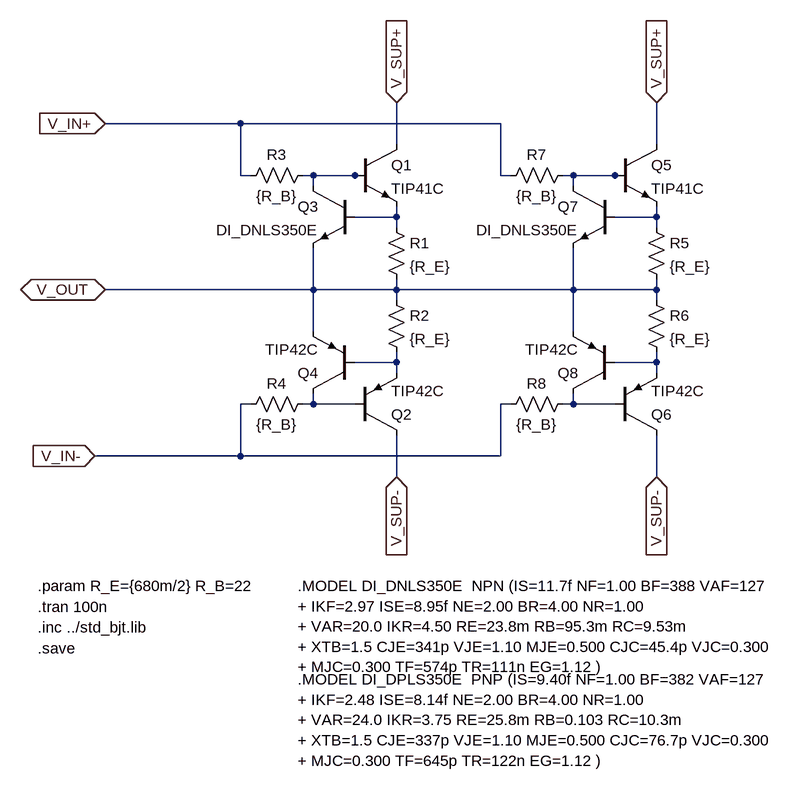
[diagram p0: schematic outstage.asc]
outstage.asc, the LTspice schematic file:
Version 4
SHEET 1 5688 824
WIRE -80 -160 -288 -160
WIRE 320 -160 -80 -160
WIRE 160 -128 160 -192
WIRE 560 -128 560 -192
WIRE -80 -80 -80 -160
WIRE -64 -80 -80 -80
WIRE 32 -80 16 -80
WIRE 96 -80 32 -80
WIRE 112 -80 96 -80
WIRE 320 -80 320 -160
WIRE 336 -80 320 -80
WIRE 432 -80 416 -80
WIRE 496 -80 432 -80
WIRE 512 -80 496 -80
WIRE 32 -64 32 -80
WIRE 432 -64 432 -80
WIRE 160 -16 160 -32
WIRE 160 -16 96 -16
WIRE 560 -16 560 -32
WIRE 560 -16 496 -16
WIRE 160 0 160 -16
WIRE 560 0 560 -16
WIRE 32 96 32 32
WIRE 32 96 -288 96
WIRE 160 96 160 80
WIRE 160 96 32 96
WIRE 432 96 432 32
WIRE 432 96 160 96
WIRE 560 96 560 80
WIRE 560 96 432 96
WIRE 160 112 160 96
WIRE 560 112 560 96
WIRE 32 160 32 96
WIRE 432 160 432 96
WIRE 160 208 160 192
WIRE 160 208 96 208
WIRE 560 208 560 192
WIRE 560 208 496 208
WIRE 160 224 160 208
WIRE 560 224 560 208
WIRE -64 272 -80 272
WIRE 32 272 32 256
WIRE 32 272 16 272
WIRE 96 272 32 272
WIRE 336 272 320 272
WIRE 432 272 432 256
WIRE 432 272 416 272
WIRE 496 272 432 272
WIRE -80 352 -80 272
WIRE -80 352 -304 352
WIRE 320 352 320 272
WIRE 320 352 -80 352
WIRE 160 384 160 320
WIRE 560 384 560 320
FLAG 160 -192 V_SUP+
IOPIN 160 -192 In
FLAG 160 384 V_SUP-
IOPIN 160 384 In
FLAG -288 -160 V_IN+
IOPIN -288 -160 In
FLAG -304 352 V_IN-
IOPIN -304 352 In
FLAG -288 96 V_OUT
IOPIN -288 96 BiDir
FLAG 560 -192 V_SUP+
IOPIN 560 -192 In
FLAG 560 384 V_SUP-
IOPIN 560 384 In
SYMBOL npn 96 -128 R0
SYMATTR InstName Q1
SYMATTR Value TIP41C
SYMBOL pnp 96 320 M180
SYMATTR InstName Q2
SYMATTR Value TIP42C
SYMBOL res 144 -16 R0
SYMATTR InstName R1
SYMATTR Value {R_E}
SYMBOL res 144 96 R0
SYMATTR InstName R2
SYMATTR Value {R_E}
SYMBOL npn 96 -64 M0
SYMATTR InstName Q3
SYMATTR Value DI_DNLS350E
SYMBOL res 32 -96 R90
WINDOW 0 0 56 VBottom 2
WINDOW 3 32 56 VTop 2
SYMATTR InstName R3
SYMATTR Value {R_B}
SYMBOL pnp 96 256 R180
SYMATTR InstName Q4
SYMATTR Value TIP42C
SYMBOL res 32 256 R90
WINDOW 0 0 56 VBottom 2
WINDOW 3 32 56 VTop 2
SYMATTR InstName R4
SYMATTR Value {R_B}
SYMBOL npn 496 -128 R0
SYMATTR InstName Q5
SYMATTR Value TIP41C
SYMBOL pnp 496 320 M180
SYMATTR InstName Q6
SYMATTR Value TIP42C
SYMBOL res 544 -16 R0
SYMATTR InstName R5
SYMATTR Value {R_E}
SYMBOL res 544 96 R0
SYMATTR InstName R6
SYMATTR Value {R_E}
SYMBOL npn 496 -64 M0
SYMATTR InstName Q7
SYMATTR Value DI_DNLS350E
SYMBOL res 432 -96 R90
WINDOW 0 0 56 VBottom 2
WINDOW 3 32 56 VTop 2
SYMATTR InstName R7
SYMATTR Value {R_B}
SYMBOL pnp 496 256 R180
SYMATTR InstName Q8
SYMATTR Value TIP42C
SYMBOL res 432 256 R90
WINDOW 0 0 56 VBottom 2
WINDOW 3 32 56 VTop 2
SYMATTR InstName R8
SYMATTR Value {R_B}
TEXT -392 616 Left 2 !.inc ../std_bjt.lib
TEXT -392 584 Left 2 !.tran 100n
TEXT -392 552 Left 2 !.param R_E={680m/2} R_B=22
TEXT -392 648 Left 2 !.save
TEXT 8 552 Left 2 !.MODEL DI_DNLS350E  NPN (IS=11.7f NF=1.00 BF=388 VAF=127\n+ IKF=2.97 ISE=8.95f NE=2.00 BR=4.00 NR=1.00\n+ VAR=20.0 IKR=4.50 RE=23.8m RB=95.3m RC=9.53m\n+ XTB=1.5 CJE=341p VJE=1.10 MJE=0.500 CJC=45.4p VJC=0.300\n+ MJC=0.300 TF=574p TR=111n EG=1.12 )
TEXT 8 696 Left 2 !.MODEL DI_DPLS350E  PNP (IS=9.40f NF=1.00 BF=382 VAF=127\n+ IKF=2.48 ISE=8.14f NE=2.00 BR=4.00 NR=1.00\n+ VAR=24.0 IKR=3.75 RE=25.8m RB=0.103 RC=10.3m\n+ XTB=1.5 CJE=337p VJE=1.10 MJE=0.500 CJC=76.7p VJC=0.300\n+ MJC=0.300 TF=645p TR=122n EG=1.12 )

The netlist it stands for:
* outstage.asc
Q1 V_SUP+ N001 N003 0 TIP41C
Q2 V_SUP- N007 N005 0 TIP42C
R1 N003 V_OUT {R_E}
R2 V_OUT N005 {R_E}
Q3 N001 N003 V_OUT 0 DI_DNLS350E
R3 N001 V_IN+ {R_B}
Q4 N007 N005 V_OUT 0 TIP42C
R4 N007 V_IN- {R_B}
Q5 V_SUP+ N002 N004 0 TIP41C
Q6 V_SUP- N008 N006 0 TIP42C
R5 N004 V_OUT {R_E}
R6 V_OUT N006 {R_E}
Q7 N002 N004 V_OUT 0 DI_DNLS350E
R7 N002 V_IN+ {R_B}
Q8 N008 N006 V_OUT 0 TIP42C
R8 N008 V_IN- {R_B}
.model NPN NPN
.model PNP PNP
.lib standard.bjt
.inc ../std_bjt.lib
.tran 100n
.param R_E={680m/2} R_B=22
.save
.MODEL DI_DNLS350E  NPN (IS=11.7f NF=1.00 BF=388 VAF=127
+ IKF=2.97 ISE=8.95f NE=2.00 BR=4.00 NR=1.00
+ VAR=20.0 IKR=4.50 RE=23.8m RB=95.3m RC=9.53m
+ XTB=1.5 CJE=341p VJE=1.10 MJE=0.500 CJC=45.4p VJC=0.300
+ MJC=0.300 TF=574p TR=111n EG=1.12 )
.MODEL DI_DPLS350E  PNP (IS=9.40f NF=1.00 BF=382 VAF=127
+ IKF=2.48 ISE=8.14f NE=2.00 BR=4.00 NR=1.00
+ VAR=24.0 IKR=3.75 RE=25.8m RB=0.103 RC=10.3m
+ XTB=1.5 CJE=337p VJE=1.10 MJE=0.500 CJC=76.7p VJC=0.300
+ MJC=0.300 TF=645p TR=122n EG=1.12 )
.backanno
.end